# EAGLE design dsPIC_I2C (EAGLE 7.2.0)
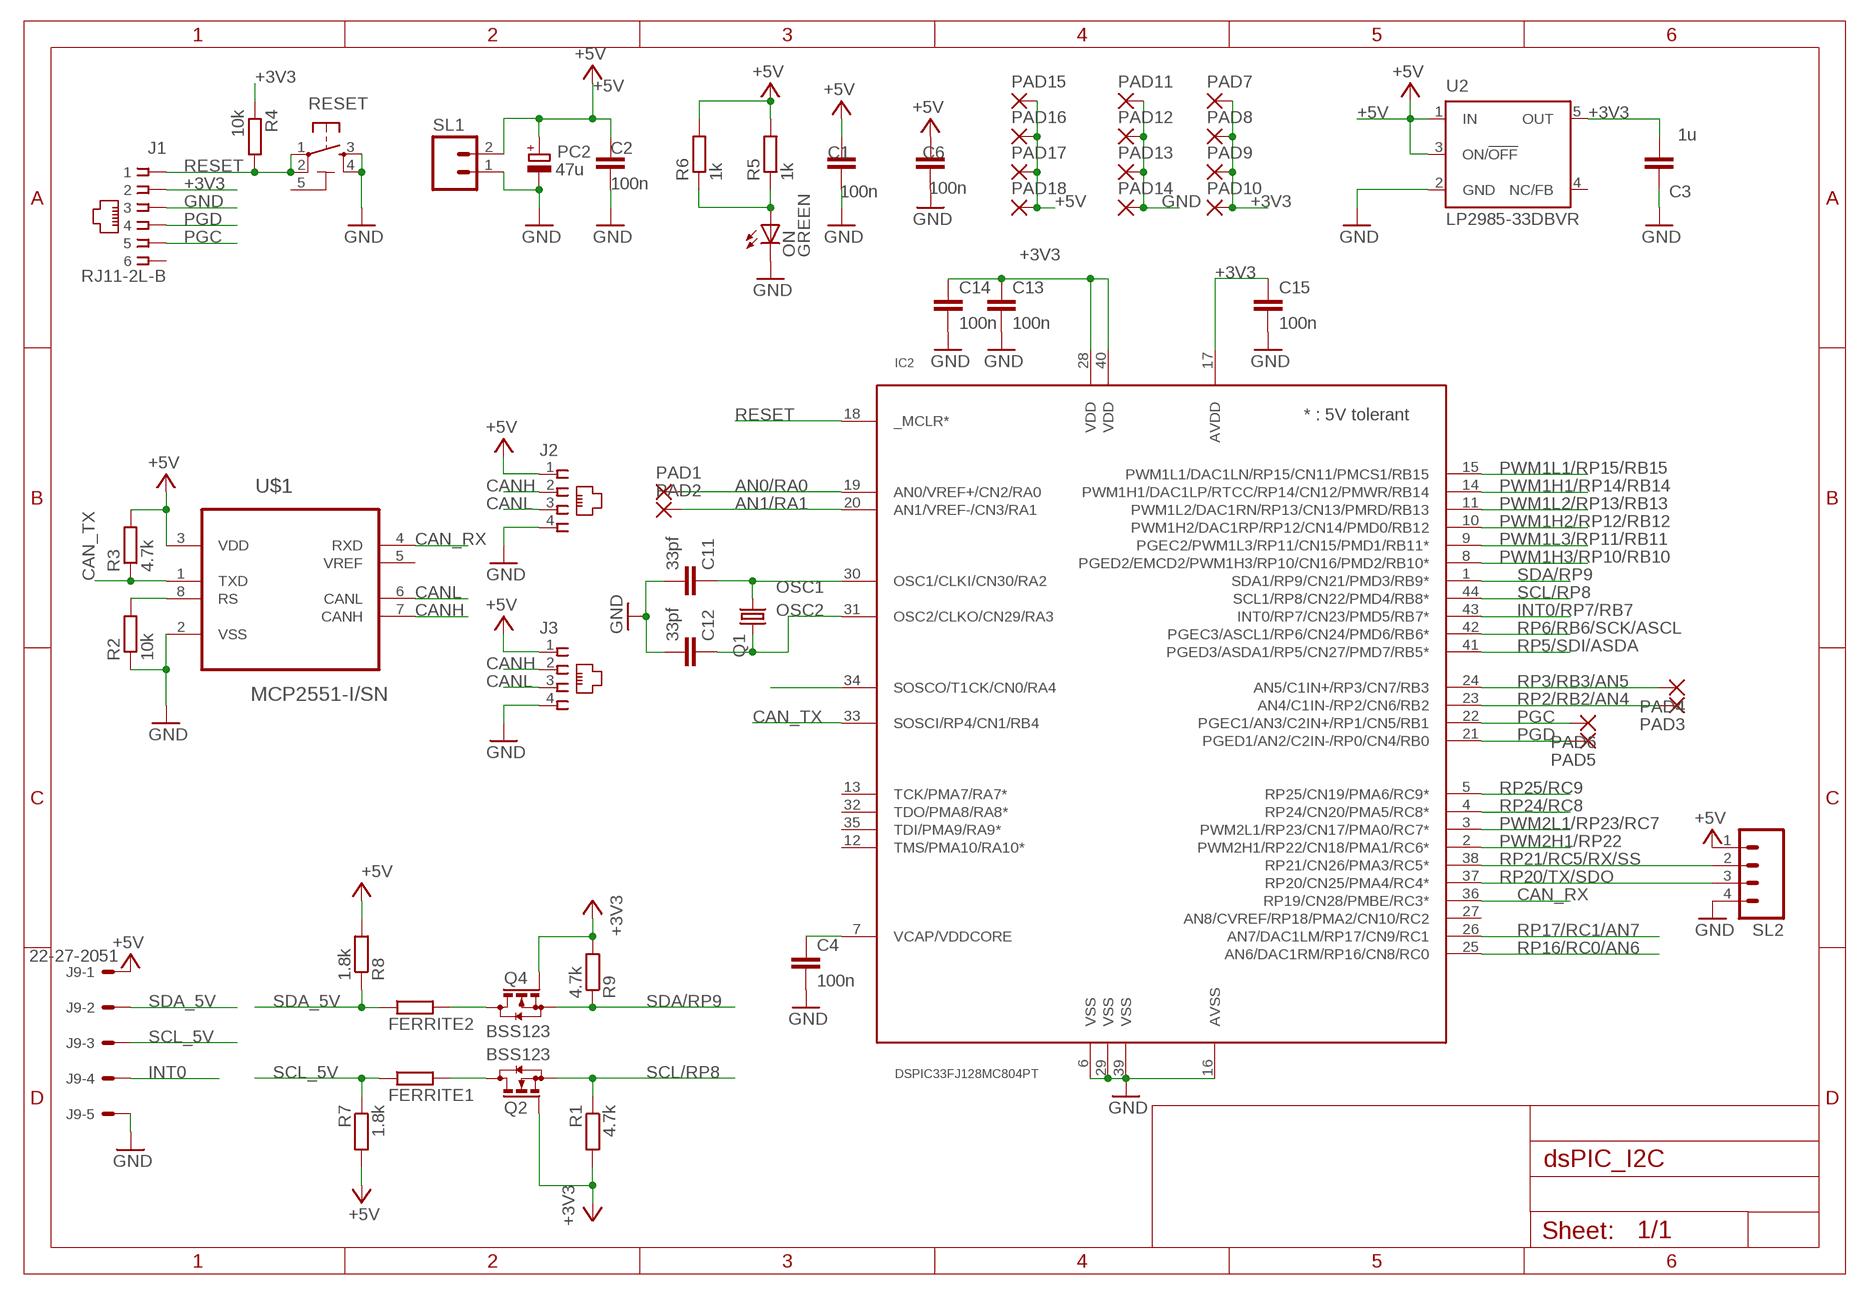
[diagram p0: schematic, sheet 1]

## Parts
C1  100n  C-EU0603-RND  [C0603-ROUND]
C2  100n  C-EU0603-RND  [C0603-ROUND]
C3  1u  C-EU0603-RND  [C0603-ROUND]
C4  100n  C-EUC0603K  [C0603K]
C6  100n  C-EUC0603K  [C0603K]
C11  33pf  C-EUC0603  [C0603]
C12  33pf  C-EUC0603  [C0603]
C13  100n  C-EUC0603  [C0603]
C14  100n  C-EUC0603  [C0603]
C15  100n  C-EUC0603  [C0603]
FERRITE1  R-EU_M0805  [M0805]
FERRITE2  R-EU_M0805  [M0805]
IC2  DSPIC33FJ128MC804PT  [TQFP44]
J1  RJ11-2L-B  [RJ11-NO_SHIELD]
J2  520249-2  [520249-2]
J3  520249-2  [520249-2]
J9  22-27-2051  22-27-2051-05  [6410-05]
ON  GREEN  LEDCHIP-LED0805  [CHIP-LED0805]
PAD1  1,6/0,9  [1,6/0,9]
PAD2  1,6/0,9  [1,6/0,9]
PAD3  1,6/0,9  [1,6/0,9]
PAD4  1,6/0,9  [1,6/0,9]
PAD5  1,6/0,9  [1,6/0,9]
PAD6  1,6/0,9  [1,6/0,9]
PAD7  1,6/0,9  [1,6/0,9]
PAD8  1,6/0,9  [1,6/0,9]
PAD9  1,6/0,9  [1,6/0,9]
PAD10  1,6/0,9  [1,6/0,9]
PAD11  1,6/0,9  [1,6/0,9]
PAD12  1,6/0,9  [1,6/0,9]
PAD13  1,6/0,9  [1,6/0,9]
PAD14  1,6/0,9  [1,6/0,9]
PAD15  1,6/0,9  [1,6/0,9]
PAD16  1,6/0,9  [1,6/0,9]
PAD17  1,6/0,9  [1,6/0,9]
PAD18  1,6/0,9  [1,6/0,9]
PC2  47u  CPOL-EUD  [PANASONIC_D]
Q1  CRYSTALSM49  [SM49]
Q2  BSS123  [SOT23]
Q4  BSS123  [SOT23]
R1  4.7k  R-EU_R0805  [R0805]
R2  10k  R-EU_R0805  [R0805]
R3  4.7k  R-EU_R0805  [R0805]
R4  10k  R-EU_R0805  [R0805]
R5  1k  R-EU_R0805  [R0805]
R6  1k  R-EU_R0805  [R0805]
R7  1.8k  R-EU_0204/7  [0204/7]
R8  1.8k  R-EU_0204/7  [0204/7]
R9  4.7k  R-EU_R0805  [R0805]
RESET  TS42031-160R-TR-7260  TS42  [TS42]
SL1  M02  [02P]
SL2  M04  [04P]
U2  LP2985-33DBVR  LP2985-XXDBVR33  [SOT23-DBV]
U$1  MCP2551-I/SN  [SOIC127P600X175-8N]

## Nets
+3V3: C3.2 C13.1 C14.1 C15.1 IC2.17(AVDD) IC2.28(VDD) IC2.40(VDD) J1.2 PAD7.1(P) PAD8.1(P) PAD9.1(P) PAD10.1(P) Q2.1(G) Q4.1(G) R1.2 R4.1 R9.2 U2.5(OUT)
+5V: C1.2 C2.2 C6.2 J2.1 J3.1 J9.1 PAD15.1(P) PAD16.1(P) PAD17.1(P) PAD18.1(P) PC2.+ R3.2 R5.2 R6.2 R7.2 R8.2 SL1.2 SL2.1 U2.1(IN) U2.3(ON/!OFF) U$1.3(VDD)
AN0/RA0: IC2.19(AN0/VREF+/CN2/RA0) PAD1.1(P)
AN1/RA1: IC2.20(AN1/VREF-/CN3/RA1) PAD2.1(P)
ASCL: FERRITE1.2 Q2.3(D)
ASDA: FERRITE2.2 Q4.3(D)
CAN_RX: IC2.36(RP19/CN28/PMBE/RC3*) U$1.4(RXD)
CAN_TX: IC2.33(SOSCI/RP4/CN1/RB4) R3.1 U$1.1(TXD)
CANH: J2.2 J3.2 U$1.7(CANH)
CANL: J2.3 J3.3 U$1.6(CANL)
GND: C1.1 C2.1 C3.1 C4.2 C6.1 C11.2 C12.2 C13.2 C14.2 C15.2 IC2.6(VSS) IC2.16(AVSS) IC2.29(VSS) IC2.39(VSS) J1.3 J2.4 J3.4 J9.5 ON.C PAD11.1(P) PAD12.1(P) PAD13.1(P) PAD14.1(P) PC2.- R2.1 RESET.3 RESET.4 SL1.1 SL2.4 U2.2(GND) U$1.2(VSS)
INT0: J9.4
INT0/RP7/RB7: IC2.43(INT0/RP7/CN23/PMD5/RB7*)
N$3: ON.A R5.1 R6.1
N$5: C4.1 IC2.7(VCAP/VDDCORE)
N$8: IC2.34(SOSCO/T1CK/CN0/RA4)
N$11: R2.2 U$1.8(RS)
OSC1: C11.1 IC2.30(OSC1/CLKI/CN30/RA2) Q1.1
OSC2: C12.1 IC2.31(OSC2/CLKO/CN29/RA3) Q1.2
PGC: IC2.22(PGEC1/AN3/C2IN+/RP1/CN5/RB1) J1.5 PAD6.1(P)
PGD: IC2.21(PGED1/AN2/C2IN-/RP0/CN4/RB0) J1.4 PAD5.1(P)
PWM1H1/RP14/RB14: IC2.14(PWM1H1/DAC1LP/RTCC/RP14/CN12/PMWR/RB14)
PWM1H2/RP12/RB12: IC2.10(PWM1H2/DAC1RP/RP12/CN14/PMD0/RB12)
PWM1H3/RP10/RB10: IC2.8(PGED2/EMCD2/PWM1H3/RP10/CN16/PMD2/RB10*)
PWM1L1/RP15/RB15: IC2.15(PWM1L1/DAC1LN/RP15/CN11/PMCS1/RB15)
PWM1L2/RP13/RB13: IC2.11(PWM1L2/DAC1RN/RP13/CN13/PMRD/RB13)
PWM1L3/RP11/RB11: IC2.9(PGEC2/PWM1L3/RP11/CN15/PMD1/RB11*)
PWM2H1/RP22: IC2.2(PWM2H1/RP22/CN18/PMA1/RC6*)
PWM2L1/RP23/RC7: IC2.3(PWM2L1/RP23/CN17/PMA0/RC7*)
RESET: IC2.18(_MCLR*) J1.1 R4.2 RESET.1 RESET.2
RP2/RB2/AN4: IC2.23(AN4/C1IN-/RP2/CN6/RB2) PAD3.1(P)
RP3/RB3/AN5: IC2.24(AN5/C1IN+/RP3/CN7/RB3) PAD4.1(P)
RP5/SDI/ASDA: IC2.41(PGED3/ASDA1/RP5/CN27/PMD7/RB5*)
RP6/RB6/SCK/ASCL: IC2.42(PGEC3/ASCL1/RP6/CN24/PMD6/RB6*)
RP16/RC0/AN6: IC2.25(AN6/DAC1RM/RP16/CN8/RC0)
RP17/RC1/AN7: IC2.26(AN7/DAC1LM/RP17/CN9/RC1)
RP20/TX/SDO: IC2.37(RP20/CN25/PMA4/RC4*) SL2.3
RP21/RC5/RX/SS: IC2.38(RP21/CN26/PMA3/RC5*) SL2.2
RP24/RC8: IC2.4(RP24/CN20/PMA5/RC8*)
RP25/RC9: IC2.5(RP25/CN19/PMA6/RC9*)
SCL/RP8: IC2.44(SCL1/RP8/CN22/PMD4/RB8*) Q2.2(S) R1.1
SCL_5V: FERRITE1.1 J9.3 R7.1
SDA/RP9: IC2.1(SDA1/RP9/CN21/PMD3/RB9*) Q4.2(S) R9.1
SDA_5V: FERRITE2.1 J9.2 R8.1
Unconnected: IC2.12(TMS/PMA10/RA10*) IC2.13(TCK/PMA7/RA7*) IC2.27(AN8/CVREF/RP18/PMA2/CN10/RC2) IC2.32(TDO/PMA8/RA8*) IC2.35(TDI/PMA9/RA9*) J1.6 U2.4(NC/FB) U$1.5(VREF)

## Power pins joined to a net without a drawn wire
5-GND: RESET.5(5-GND)

## Library data of the parts
C1 C2 C4 C6 = SmartPrj:C-EU: CAPACITOR, European symbol; OC_FARNELL: 2210925
C3 = SmartPrj:C-EU: CAPACITOR, European symbol; OC_FARNELL: 2346901
C11 C12 = LibPerso:C-EU: CAPACITOR, European symbol; OC_FARNELL: 1740598
C13-C15 = LibPerso:C-EU: CAPACITOR, European symbol; OC_FARNELL: 2210925
FERRITE1 FERRITE2 = LibPerso:R-EU_: RESISTOR, European symbol; OC_FARNELL: 2292459
IC2 = microchip-dspic33:DSPIC33F*04
J1 = LibPerso:RJ11: CORCOM Modular RJ Jacks No Shield Source: www.tycoelectronics.com .. ENG_DS_1654001_1099_RJ_L_0507.pdf; MF: TYCO ELECTRONICS; MPN: RJ11-2L-B; OC_FARNELL: 1393306; OC_NEWARK: 83F4463
J2 J3 = LibPerso:520249-2: AMP connector; OC_FARNELL: 1137972; OC_RS: 477-359
J9 = con-molex:22-?-05: CONNECTOR wire to board 2.54 mm (.1 inch) pitch header; OC_FARNELL: unknown; OC_NEWARK: unknown
ON = led:LED: LED OSRAM: - CHIPLED LG R971, LG N971, LY N971, LG Q971, LY Q971, LO R971, LY R971 LH N974, LH R974 LS Q976, LO Q976, LY Q976 LO Q996 - Hyper CHIPLED LW Q18S LB Q993, LB Q99A, LB R99A - SideLED LS A670, LO A670, LY A670, LG A670, LP A670 LB A673, LV A673, LT A673, LW A673 LH A674 LY A675 LS A676, LA A676, LO A676, LY A676, LW A676 LS A679, LY A679, LG A679 - Hyper Micro SIDELED® LS Y876, LA Y876, LO Y876, LY Y876 LT Y87S - SmartLED LW L88C, LW L88S LB L89C, LB L89S, LG L890 LS L89K, LO L89K, LY L89K LS L896, LA L896, LO L896, LY L896 - TOPLED LS T670, LO T670, LY T670, LG T670, LP T670 LSG T670, LSP T670, LSY T670, LOP T670, LYG T670 LG T671, LOG T671, LSG T671 LB T673, LV T673, LT T673, LW T673 LH T674 LS T676, LA T676, LO T676, LY T676, LB T676, LH T676, LSB T676, LW T676 LB T67C, LV T67C, LT T67C, LS T67K, LO T67K, LY T67K, LW E67C LS E67B, LA E67B, LO E67B, LY E67B, LB E67C, LV E67C, LT E67C LW T67C LS T679, LY T679, LG T679 LS T770, LO T770, LY T770, LG T770, LP T770 LB T773, LV T773, LT T773, LW T773 LH T774 LS E675, LA E675, LY E675, LS T675 LS T776, LA T776, LO T776, LY T776, LB T776 LHGB T686 LT T68C, LB T68C - Hyper Mini TOPLED® LB M676 - Mini TOPLED Santana® LG M470 LS M47K, LO M47K, LY M47K Source: http://www.osram.convergy.de LUXEON: - LUMILED® LXK2-PW12-R00, LXK2-PW12-S00, LXK2-PW14-U00, LXK2-PW14-V00 LXK2-PM12-R00, LXK2-PM12-S00, LXK2-PM14-U00 LXK2-PE12-Q00, LXK2-PE12-R00, LXK2-PE12-S00, LXK2-PE14-T00, LXK2-PE14-U00 LXK2-PB12-K00, LXK2-PB12-L00, LXK2-PB12-M00, LXK2-PB14-N00, LXK2-PB14-P00, LXK2-PB14-Q00 LXK2-PR12-L00, LXK2-PR12-M00, LXK2-PR14-Q00, LXK2-PR14-R00 LXK2-PD12-Q00, LXK2-PD12-R00, LXK2-PD12-S00 LXK2-PH12-R00, LXK2-PH12-S00 LXK2-PL12-P00, LXK2-PL12-Q00, LXK2-PL12-R00 Source: www.luxeon.com KINGBRIGHT: KA-3528ASYC Source: www.kingbright.com; OC_FARNELL: 8529906
PAD1-PAD18 = wirepad:1,6/0,9: THROUGH-HOLE PAD
PC2 = rcl:CPOL-EU: POLARIZED CAPACITOR, European symbol; OC_FARNELL: 1850100
Q1 = crystal:CRYSTAL: CRYSTAL; OC_FARNELL: 1842332; OC_NEWARK: unknown
Q2 Q4 = transistor-small-signal:BSS123: N-CHANNEL MOS FET
R1 R7-R9 = rcl:R-EU_: RESISTOR, European symbol
R2-R6 = LibPerso:R-EU_: RESISTOR, European symbol
RESET = SmartPrj:TS42: TS42 Dongnan Electronics Tact switch VDC 12V - 50mA; OC_FARNELL: 2060823
SL1 = con-amp-quick:M02: AMP QUICK CONNECTOR; OC_FARNELL: unknown; OC_NEWARK: unknown
SL2 = con-amp-quick:M04: AMP QUICK CONNECTOR; OC_FARNELL: unknown; OC_NEWARK: unknown
U2 = SmartPrj:LP2985-XXDBVR: ULTRALOW-POWER 50-mA LOW-DROPOUT LINEAR REGULATORS 50-mA Low-Dropout Regulator Source: http://focus.ti.com/lit/ds/symlink/tps77001.pdf; OC_FARNELL: 2395925
U$1 = LibPerso:MCP2551-I/SN: High-Speed CAN Transceiver; MPN: MCP2551-I/SN; OC_FARNELL: 9758569; OC_NEWARK: 69K7604; PACKAGE: SOIC-8; SUPPLIER: Microchip

## Net classes
0 default: width 0.254 mm, clearance 0.254 mm
1 power: width 0.61 mm, drill 0.61 mm, clearance 0.254 mm
2 gnd: width 0.305 mm, drill 0.559 mm, clearance 0.254 mm
3 usbvcc: width 0.508 mm, drill 0.61 mm, clearance 0.254 mm
4 aref: width 0.406 mm, drill 0.61 mm, clearance 0.254 mm

## Board
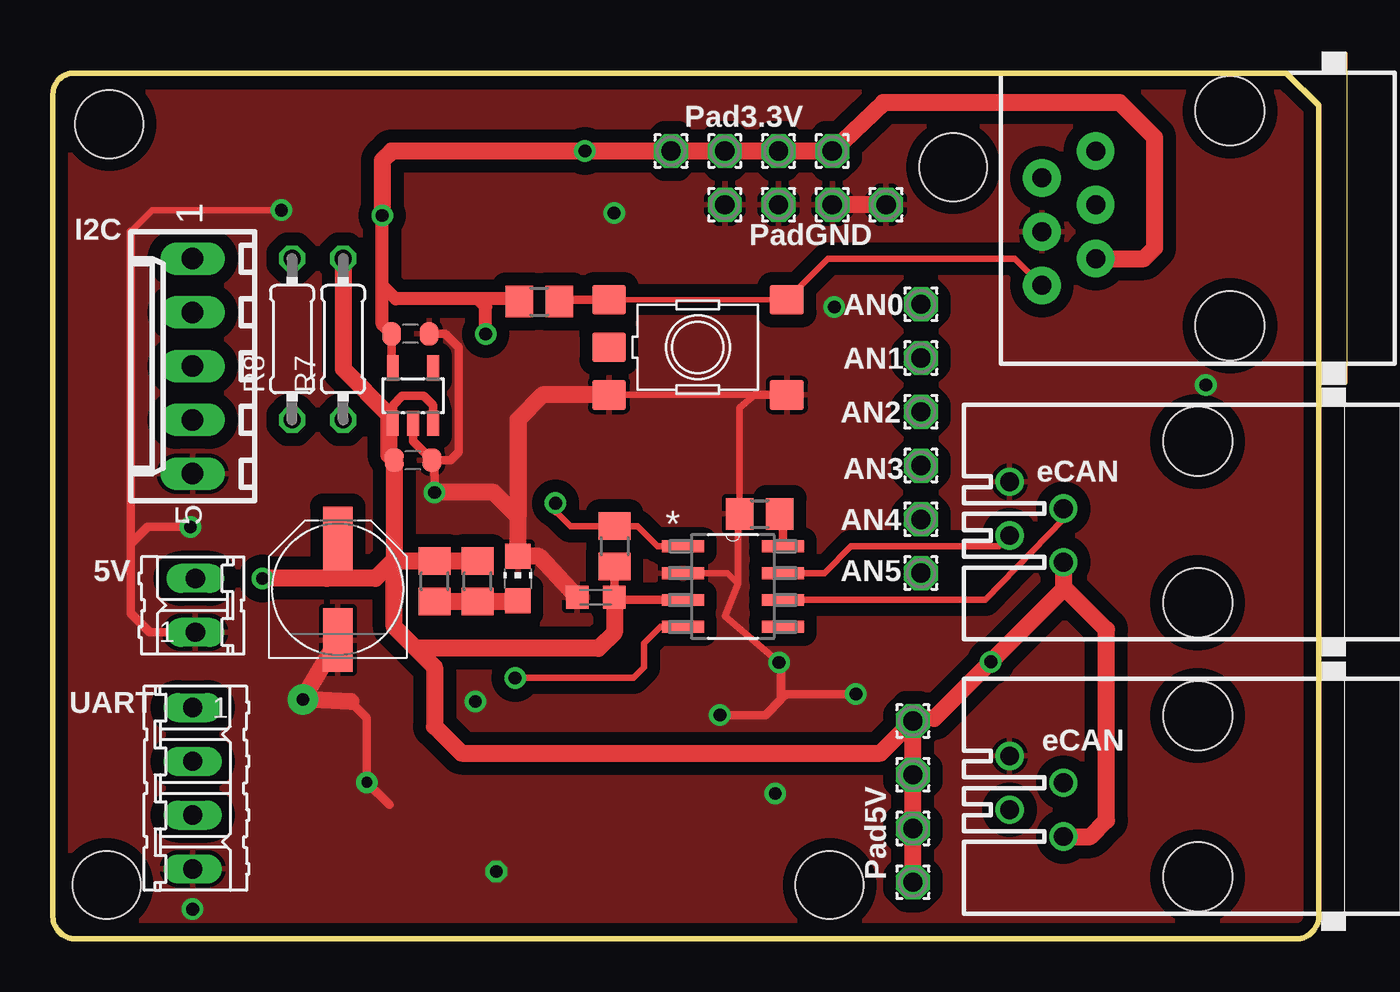
[diagram p1: board, top side]
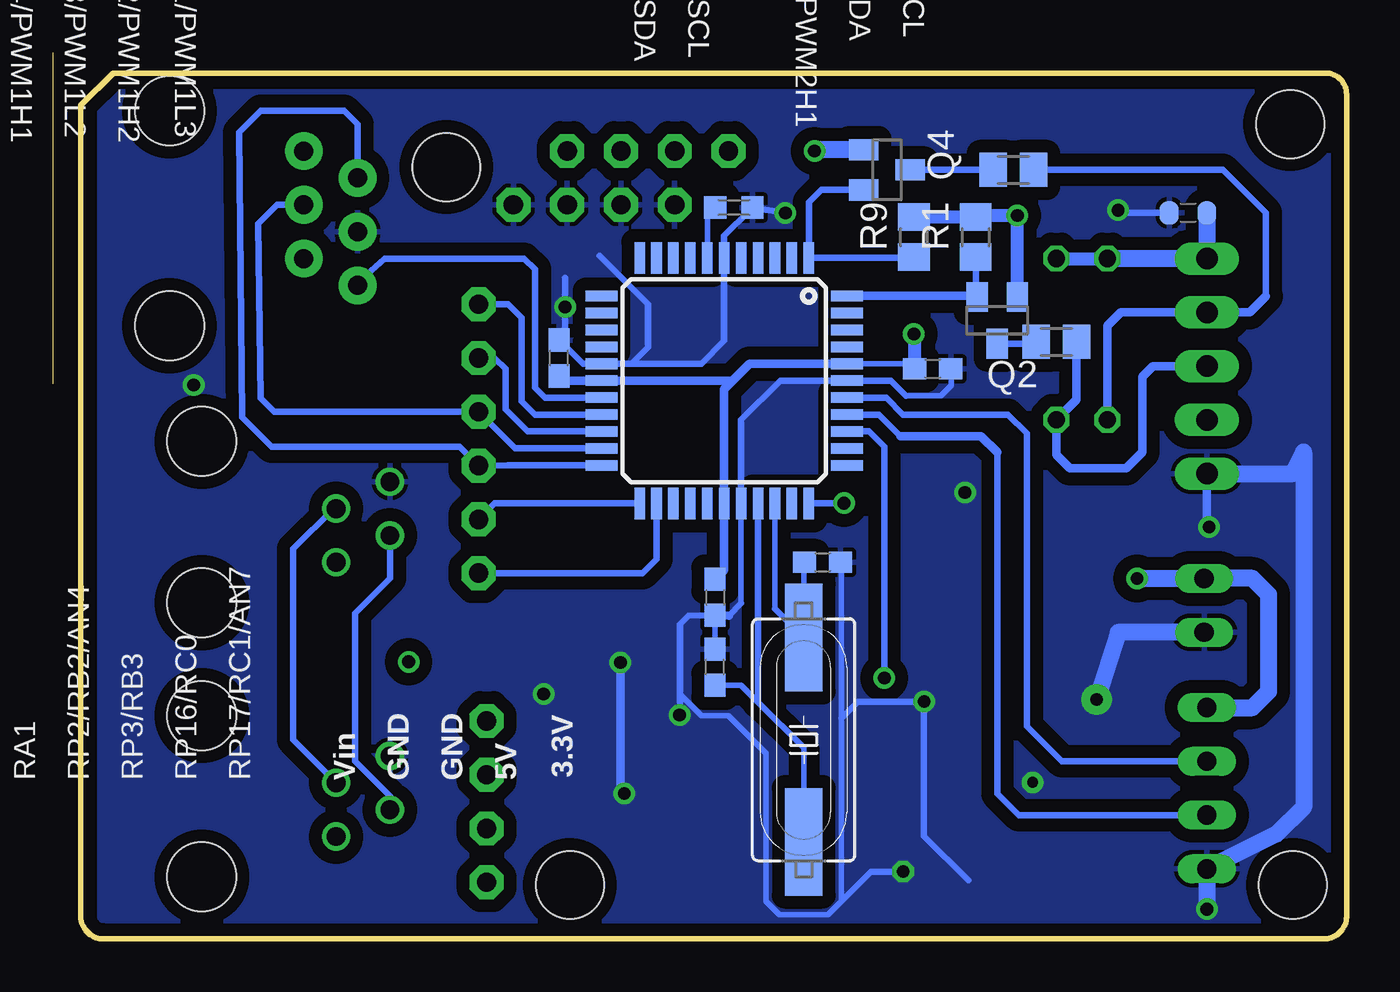
[diagram p2: board, bottom side, seen from below]

Size 59.82 x 40.89 mm. Coordinates in mm from the lower left corner, seen from the top.
Outline: 58.29,40.89 59.82,39.37 59.82,1.13 arc-90 58.82,0 1,0 arc-90 0,1.13 0,39.89 arc-90 1,40.89 58.29,40.89
Copper layers (1*16): Top 0.018mm / dielectric 1.55mm / Bottom 0.018mm
Design rules "eC_2Layer_PClass6_BaseCopperO18_eCDefault": minimum track width 0.15mm, minimum drill 0.35mm, track to track 0.15mm, track to pad 0.15mm, pad to pad 0.15mm, via to via 0.15mm, smd to smd 0mil, copper to edge 0.25mm, drill to drill 0.35mm, minimum pad ring 0.175mm, minimum via ring 0.125mm, stop-mask expansion 0mil, vias tented up to drill 0.45mm, thermal gap 0.2mm
Holes 3.2 mm at 42.55,36.45 36.7,2.54 2.67,38.48 2.54,2.54
vRestrict: area 50.4,12.8 to 51.1,13.3; area 53,12.7 to 53.5,13.6

### Footprints (pad centres in the part's own frame; a part is rotated, then mirrored left to right if it is on the bottom)
C0603-ROUND = smd 0.898 x 1.1: 1 -0.889,0; 2 0.889,0
C0603K = smd 1.05 x 1.08: 1 -0.875,0; 2 0.875,0
C0603 = smd 1.1 x 1: 1 -0.85,0; 2 0.85,0
M0805 = smd 1.3 x 1.6: 1 -0.95,0; 2 0.95,0
TQFP44 = smd 1.5 x 0.5: 1 -5.8,4; 2 -5.8,3.2; 3 -5.8,2.4; 4 -5.8,1.6; 5 -5.8,0.8; 6 -5.8,0; 7 -5.8,-0.8; 8 -5.8,-1.6; 9 -5.8,-2.4; 10 -5.8,-3.2; 11 -5.8,-4; 23 5.8,-4; 24 5.8,-3.2; 25 5.8,-2.4; 26 5.8,-1.6; 27 5.8,-0.8; 28 5.8,0; 29 5.8,0.8; 30 5.8,1.6; 31 5.8,2.4; 32 5.8,3.2; 33 5.8,4 | smd 0.5 x 1.5: 12 -4,-5.8; 13 -3.2,-5.8; 14 -2.4,-5.8; 15 -1.6,-5.8; 16 -0.8,-5.8; 17 0,-5.8; 18 0.8,-5.8; 19 1.6,-5.8; 20 2.4,-5.8; 21 3.2,-5.8; 22 4,-5.8; 34 4,5.8; 35 3.2,5.8; 36 2.4,5.8; 37 1.6,5.8; 38 0.8,5.8; 39 0,5.8; 40 -0.8,5.8; 41 -1.6,5.8; 42 -2.4,5.8; 43 -3.2,5.8; 44 -4,5.8
RJ11-NO_SHIELD = drill 0.9 pad 1.778: 1 -3.175,8.89; 2 -1.905,6.35; 3 -0.635,8.89; 4 0.635,6.35; 5 1.905,8.89; 6 3.175,6.35 | hole 3.251: -5.08,0; 5.08,0
520249-2 = drill 0.889: 1 -1.905,6.35; 2 -0.635,8.89; 3 0.635,6.35; 4 1.905,8.89 | hole 3.251: -3.81,0; 3.81,0
6410-05 = drill 1.016 long: 1 5.08,0; 2 2.54,0; 3 0,0; 4 -2.54,0; 5 -5.08,0
CHIP-LED0805 = smd 1.2 x 1.2: A 0,-1.05; C 0,1.05
1,6/0,9 = drill 0.914 pad 1.6 octagon: 1 0,0
PANASONIC_D = smd 3 x 1.4: + 2.4,0; - -2.4,0
SM49 = smd 5.08 x 1.778: 1 -4.826,0; 2 4.826,0
SOT23 = smd 1 x 1.4: 1 -0.95,-1.1; 2 0.95,-1.1; 3 0,1.1
R0805 = smd 1.3 x 1.5: 1 -0.95,0; 2 0.95,0
0204/7 = drill 0.813 octagon: 1 -3.81,0; 2 3.81,0
TS42 = smd 1.6 x 1.4: 1 -4.2,2.25; 2 4.2,2.25; 3 -4.2,-2.25; 4 4.2,-2.25; 5 -4.2,0
02P = drill 0.914 long: 1 -1.27,0; 2 1.27,0
04P = drill 0.914 long: 1 -3.81,0; 2 -1.27,0; 3 1.27,0; 4 3.81,0
SOT23-DBV = smd 0.55 x 1.2: 1 -0.95,-1.3; 2 0,-1.3; 3 0.95,-1.3; 4 0.95,1.3; 5 -0.95,1.3
SOIC127P600X175-8N = smd 1.981 x 0.559: 1 -2.362,1.905; 2 -2.362,0.635; 3 -2.362,-0.635; 4 -2.362,-1.905; 5 2.362,-1.905; 6 2.362,-0.635; 7 2.362,0.635; 8 2.362,1.905

### Placement (x,y rotation side)
C1  17.02,22.61 180 top
C2  7.49,34.29 0 bottom
C3  16.89,28.57 180 top
C4  28.96,34.54 0 bottom
C6  25.66,16.13 0 top
C11  29.85,12.83 90 bottom
C12  24.77,17.78 0 bottom
C13  19.56,26.92 0 bottom
C14  29.85,16.13 270 bottom
C15  37.21,27.43 90 bottom
FERRITE1  13.72,28.19 180 bottom
FERRITE2  15.75,36.32 180 bottom
IC2  29.41,26.36 270 bottom
J1  55.63,34.04 90 top
J2  54.1,19.68 90 top
J3  54.1,6.73 90 top
J9  6.61,27.05 90 top
ON  21.97,17.02 0 top
PAD1  41.02,29.97 0 top
PAD2  41.02,27.43 0 top
PAD3  41.02,19.81 0 top
PAD4  41.02,17.27 0 top
PAD5  41.02,24.89 0 top
PAD6  41.02,22.35 0 top
PAD7  29.21,37.21 90 top
PAD8  31.75,37.21 90 top
PAD9  34.29,37.21 90 top
PAD10  36.83,37.21 90 top
PAD11  31.75,34.67 90 top
PAD12  34.29,34.67 90 top
PAD13  36.83,34.67 90 top
PAD14  39.37,34.67 90 top
PAD15  40.64,2.67 180 top
PAD16  40.64,5.21 180 top
PAD17  40.64,7.75 180 top
PAD18  40.64,10.29 180 top
PC2  13.46,16.51 90 top
Q1  25.66,9.4 90 bottom
Q2  16.51,29.21 180 bottom
Q4  21.72,36.32 270 bottom
R1  17.53,33.15 90 bottom
R2  33.4,20.07 0 top
R3  26.54,18.54 270 top
R4  22.99,30.1 0 top
R5  20.07,16.89 90 top
R6  18.04,16.89 90 top
R7  13.72,28.32 90 top
R8  11.3,28.32 90 top
R9  20.45,33.15 90 bottom
RESET  30.48,27.94 0 top
SL1  6.73,15.75 90 top
SL2  6.61,7.11 270 top
U2  17.02,25.65 0 top
U$1  32.13,16.64 0 top

### Tracks (layer width: path | path; a pad name or v marks a point on that pad's centre or on a via)
+3V3  (via drill 0.6 pad 1.02)
  Top 0.406: U2.5 16,27.02 C3.2
  Top 0.61: C3.2 15.56,29.02 15.56,30.86 | 15.56,30.86 v15.56,34.16 | v20.45,28.57 20.45,29.84 20.07,30.23 | 20.07,30.23 16.2,30.23 15.56,30.86 | R4.1 21.91,30.23 20.07,30.23
  Top 0.813: v15.56,34.16 15.56,36.77 16,37.21 v25.15,37.21 PAD7.1 PAD8.1 PAD9.1 PAD10.1 39.24,39.5 50.42,39.5 52.07,37.85 52.07,32.64 51.56,32.13 J1.2
  Bottom 0.254: IC2.40 20.67,27.16 C13.1 | 28.21,27.16 29.01,26.36
  Bottom 0.305: 37.25,26.36 C15.1
  Bottom 0.406: IC2.40 28.21,27.16 29.41,25.96 IC2.28 29.41,17.41 C14.1 | 29.01,26.36 IC2.17 37.25,26.36 | 17.46,34.16 R1.2
  Bottom 0.61: 17.46,34.16 v15.56,34.16 Q2.1 | C13.1 20.41,28.54 v20.45,28.57 | R9.2 R1.2
  Bottom 0.813: Q4.1 25.09,37.27 v25.15,37.21
+5V  (via drill 0.6 pad 1.02)
  Top 0.406: U2.1 16.07,25.21 16.51,25.65 17.53,25.65 17.97,25.21 U2.3 | U2.1 16.13,24.29 | R3.2 26.53,17.58 C6.2 26.66,16 U$1.3 | U2.1 16.07,24.57 15.88,24.77
  Top 0.813: 16.13,17.91 C1.2 15.88,22.86 15.88,24.77 13.72,26.92 R7.2 | 16.13,17.91 16.06,17.84 | 12.96,17.02 15.24,17.02 16.06,17.84 | 12.96,17.02 v9.91,17.02 | PC2.+ 13.46,17.53 12.96,17.02 | R6.2 R5.2 16.06,17.84 | C6.2 26.53,14.46 25.78,13.72 17.15,13.72 | 17.15,13.72 16.13,14.73 16.13,17.91 | 17.15,13.72 18.04,12.83 18.04,10.03 19.31,8.76 39.12,8.76 PAD18.1 | J2.1 47.75,16.64 | 47.75,16.64 47.75,16.51 v44.32,13.08 41.66,10.41 40.77,10.41 PAD18.1 | J3.1 49.02,4.83 49.79,5.59 49.79,14.61 47.75,16.64 | PAD15.1 PAD16.1 PAD17.1 PAD18.1
  Bottom 0.61: R7.2 R8.2
  Bottom 0.813: R8.2 J9.1 C2.2 | v9.91,17.02 SL1.2 4.45,17.02 3.68,16.26 3.68,11.68 4.45,10.92 SL2.1
AN0/RA0
  Bottom 0.305: IC2.19 38.35,24.76 38.99,25.4 38.99,29.34 39.63,29.97 PAD1.1
AN1/RA1
  Bottom 0.305: IC2.20 38.7,23.96 39.75,25.02 39.75,26.92 40.26,27.43 PAD2.1
ASCL
  Bottom 0.305: Q2.3 14.75,28.11
  Bottom 0.406: 14.75,28.11 FERRITE1.2
ASDA
  Bottom 0.305: Q4.3 FERRITE2.2
CAN_RX  (via drill 0.6 pad 1.02)
  Top 0.305: v21.85,12.32 27.43,12.32 27.94,12.83 27.94,13.97 28.7,14.73 U$1.4
  Bottom 0.305: IC2.36 22.57,23.96 21.85,23.24 v21.85,12.32
CAN_TX  (via drill 0.6 pad 1.02)
  Top 0.305: 23.75,20.19 24.45,19.49 R3.1 27.63,19.49 28.58,18.54 U$1.1
  Top 0.406: 23.75,20.19 v23.75,20.57
  Bottom 0.305: IC2.33 v23.75,20.56
  Bottom 0.406: v23.75,20.56 v23.75,20.57
CANH
  Top 0.305: U$1.7 36.45,17.27 37.72,18.54 44.71,18.54 J2.2
  Bottom 0.305: J3.2 45.21,6.73 46.86,8.38 46.86,15.37 45.21,17.02 J2.2
CANL
  Top 0.305: U$1.6 44.07,16 47.75,19.81 J2.3
  Bottom 0.305: J3.3 49.79,9.4 49.79,18.41 47.88,20.32 J2.3
GND  (via drill 0.5 pad 1.02, 0.6 pad 1.02, 0.6 pad 1.42)
  Top 0.305: U$1.2 31.88,17.27 32.39,16.76 | 32.39,16.76 31.75,15.24 v34.32,13.06 | 32.39,19.87 32.39,16.76 | 33.18,25.69 32.45,25.09 R2.1 | RESET.3 RESET.4 | v10.8,34.42 4.7,34.42 3.68,33.4
  Top 0.406: C3.1 18.54,28.57 19.18,27.94 19.18,22.99 18.8,22.61 C1.1 | U2.2 17.02,23.49 C1.1 | R2.1 32.39,19.87 | RESET.4 33.18,25.69 | v18.04,21.08 18.04,22.48 C1.1 | 14.07,11.2 14.84,10.44 v14.84,7.39 15.9,6.33 | v6.5,19.46 4.47,19.46 3.68,18.67 | 3.68,18.67 3.68,15.37 4.57,14.48 SL1.1 | v31.52,10.57 33.68,10.57 34.42,11.3 | 34.42,11.3 34.42,12.95 v34.32,13.06 | v37.95,11.56 34.67,11.56 34.42,11.3 | 3.68,33.4 3.68,18.67
  Top 0.813: C6.1 22.97,18.07 ON.C 21.97,19.94 | 21.97,19.94 20.83,21.08 v18.04,21.08 | RESET.3 23.15,25.69 21.97,24.51 21.97,19.94 | 14.07,11.2 v11.81,11.3 PC2.- 13.46,14.48 | PAD14.1 36.7,34.67
  Bottom 0.254: 28.61,15.84 28.61,20.07 IC2.29 | 31.1,15.25 31.5,14.86 | 31.5,14.48 31.5,11.56 30.48,10.54 29.21,10.54 27.43,8.76 27.43,1.78 26.8,1.14 24.51,1.14 23.88,1.78 23.88,10.41 23.88,17.74 | C14.2 C11.2 | 20.83,25.65 19.18,25.65 18.68,26.15 C13.2
  Bottom 0.305: 29.2,15.25 28.61,15.84 | C14.2 31.1,15.25 | 31.5,14.86 31.5,14.48 31.5,10.59 v31.52,10.57 | 20.83,25.65 21.54,26.36 IC2.39 26.76,26.36 28.61,24.51 28.61,20.07 | IC2.16 36.09,27.16 37.06,28.13 | 23.88,10.41 23.09,11.2 v19.97,11.2 19.97,4.85 17.88,2.77 | 35.31,32.26 33.02,29.97 33.02,27.94 33.8,27.16 IC2.16 | 36.93,28.15 v36.93,29.84 36.93,31.22 | IC2.16 30.5,27.16 29.41,28.25 IC2.6 29.41,33.2 28.2,34.42 C4.2 v26.52,34.29 | 23.88,1.78 22.48,3.17 v20.96,3.17 | C2.1 10.67,34.29
  Bottom 0.406: 23.88,17.74 C12.2 | C14.2 29.2,15.25 | C15.2 36.93,28.15 37.06,28.13 | v6.5,19.46 6.61,19.56 J9.5 | v34.14,6.86 34.32,7.04 v34.32,13.06 | 10.67,34.29 v10.8,34.42
  Bottom 0.813: SL1.1 10.8,14.48 v11.81,11.3 | v6.61,1.4 SL2.4 3.3,4.95 2.03,6.22 2.03,22.99 2.54,21.97 J9.5
  other vias: 54.48,26.16
  pour Bottom (isolate 0.61, rank 2): 0.64,40.13 58.93,40.13 58.93,0.51 0.64,0.64
  pour Top (isolate 0.61, rank 2): 0.64,40.13 59.06,40.13 59.06,0.64 0.64,0.64 0.51,21.84
N$3
  Top 0.813: R6.1 R5.1 21.95,15.94 ON.A
N$5
  Bottom 0.254: IC2.7 30.21,34.45 C4.1
N$11
  Top 0.406: R2.2 34.49,19.81 U$1.8
OSC1
  Bottom 0.254: Q1.1 25.66,9.02 27.81,11.17 28.62,11.98 C11.1
  Bottom 0.305: IC2.30 27.81,11.17
OSC2
  Bottom 0.254: C12.1 25.66,17.74 Q1.2 | IC2.31 27.01,15.58
  Bottom 0.305: 27.01,15.58 Q1.2
PGC
  Bottom 0.305: J1.5 46.74,38.48 47.37,39.12 51.31,39.12 52.33,38.1 52.2,24.64 50.8,23.24 41.91,23.24 PAD6.1 39.63,22.36 IC2.22
PGD
  Bottom 0.305: J1.4 50.55,34.67 51.44,33.78 51.31,25.53 50.67,24.89 PAD5.1 39.29,23.16 IC2.21
RESET
  Top 0.254: RESET.2 RESET.1
  Top 0.305: RESET.2 36.62,32.13 45.47,32.13 J1.1
  Top 0.406: R4.2 24.03,30.19 RESET.1
  Bottom 0.305: IC2.18 37.88,25.56 38.36,26.04 38.36,31.62 38.86,32.13 45.47,32.13 46.74,30.99 J1.1
RP2/RB2/AN4
  Bottom 0.305: IC2.23 40.27,20.56 PAD3.1
RP3/RB3/AN5
  Bottom 0.305: IC2.24 32.61,17.93 33.28,17.27 PAD4.1
RP20/TX/SDO
  Bottom 0.305: SL2.3 15.5,5.84 16.51,6.86 16.51,22.99 | 21.08,23.75 22.1,24.77 IC2.37
  Bottom 0.406: 16.51,22.99 17.27,23.75 21.08,23.75 | IC2.37
RP21/RC5/RX/SS
  Bottom 0.305: IC2.38 21.75,25.56 20.96,24.77 16,24.77 15.11,23.88 15.11,10.03 13.46,8.38 SL2.2
SCL/RP8
  Bottom 0.305: R1.1 17.53,30.38
  Bottom 0.406: IC2.44 17.51,30.36 Q2.2 17.53,30.38
SCL_5V
  Bottom 0.406: FERRITE1.1 12.77,25.46 R7.1 13.72,22.86 13.08,22.22 10.42,22.22 9.65,22.99 9.65,26.54 9.15,27.05 J9.3
SDA/RP9
  Bottom 0.305: 20.48,32.16 IC2.1 25.41,34.79 24.83,35.37 Q4.2
  Bottom 0.406: 20.48,32.16 R9.1
SDA_5V
  Bottom 0.305: FERRITE2.1 5.84,36.32 3.81,34.29 3.81,30.35
  Bottom 0.406: 3.81,30.35 4.57,29.59 J9.2 10.67,29.59 11.3,28.96 R8.1

### Text on the board
tPlace: Pad3.3V | I2C | PadGND | AN0 | AN1 | AN2 | AN3 | eCAN | AN4 | 5V | AN5 | UART | eCAN | Pad5V
bNames: RP8/RB8/SCL | RP9/RB9/SDA | RP22/RC6/PWM2H1 | RP6/RB6/ASCL | RP5/RB5/ASDA | RP20/RC4 | RP21/RC5 | RP7/RB7 | PWM2L1 | RP24 | RP25 | RP10 | RP11/RB11/PWM1L3 | RP12/RB12/PWM1H2 | RP13/RB13/PWM1L2 | RP14/RB14/PWM1H1 | RP15/RB15/PWM1L1 | 3.3V | 5V | GND | GND | Vin | RP17/RC1/AN7 | RP16/RC0 | RP3/RB3 | RP2/RB2/AN4 | RA1 | RA0
214bmp: D:/SmartProjects/Snc/a4_bn_logo2.bmp